# EAGLE schematic dimmerPower5 (EAGLE 9.2.0)
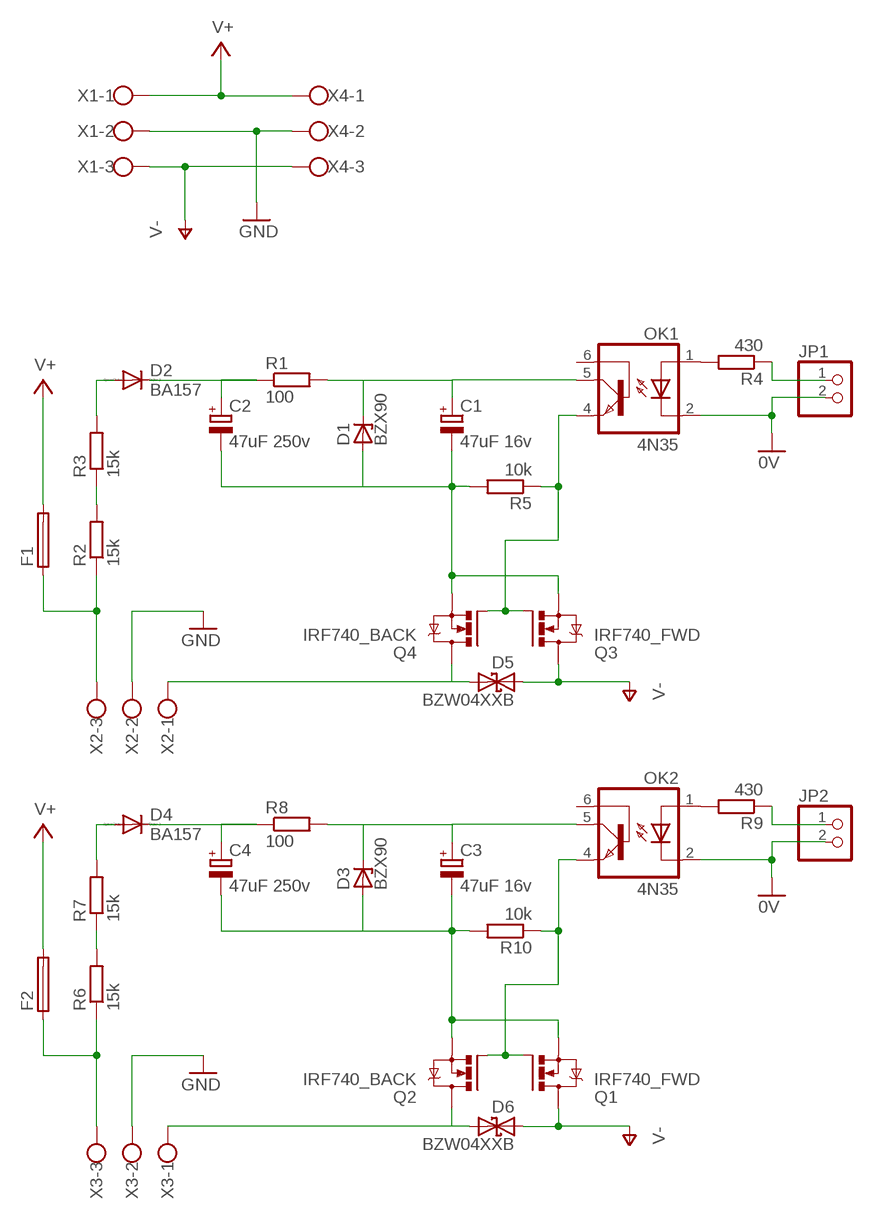
[diagram p0: schematic, sheet 1]

## Parts
C1  47uF 16v  CPOL-EUE2.5-6  [E2,5-6]
C2  47uF 250v  CPOL-EUE5-13  [E5-13]
C3  47uF 16v  CPOL-EUE2.5-6  [E2,5-6]
C4  47uF 250v  CPOL-EUE5-13  [E5-13]
D1  BZX90  [DO34Z7]
D2  BA157  [P1-10]
D3  BZX90  [DO34Z7]
D4  BA157  [P1-10]
D5  BZW04XXB  [F126Z12]
D6  BZW04XXB  [F126Z12]
F1  SH22,5  [SH22,5]
F2  SH22,5  [SH22,5]
JP1  PINHD-1X2  [1X02]
JP2  PINHD-1X2  [1X02]
OK1  4N35  [DIL06]
OK2  4N35  [DIL06]
Q1  IRF740_FWD  [TO220BV_FWD]
Q2  IRF740_BACK  [TO220BV_BACK]
Q3  IRF740_FWD  [TO220BV_FWD]
Q4  IRF740_BACK  [TO220BV_BACK]
R1  100  R-EU_0204/7  [0204/7]
R2  15k  R-EU_0613/15  [P0613/15]
R3  15k  R-EU_0613/15  [P0613/15]
R4  430  R-EU_0204/7  [0204/7]
R5  10k  R-EU_0204/7  [0204/7]
R6  15k  R-EU_0613/15  [P0613/15]
R7  15k  R-EU_0613/15  [P0613/15]
R8  100  R-EU_0204/7  [0204/7]
R9  430  R-EU_0204/7  [0204/7]
R10  10k  R-EU_0204/7  [0204/7]
X1  W237-103  [W237-103]
X2  W237-103  [W237-103]
X3  W237-103  [W237-103]
X4  W237-103  [W237-103]

## Nets
0V: JP1.2 JP2.2 OK1.2(C) OK2.2(C)
GND: X1.2 X2.2 X3.2 X4.2
N$1: C1.- C2.- D1.A Q3.S Q4.S R5.2
N$2: JP1.1 R4.1
N$3: OK1.1(A) R4.2
N$5: F1.1 R2.1 X2.3
N$6: R6.2 R7.1
N$7: R2.2 R3.1
N$8: D2.A R3.2
N$9: C2.+ D2.C R1.1
N$10: C1.+ D1.C OK1.5(COL) R1.2
N$11: OK1.4(EMI) Q3.G Q4.G R5.1
N$12: D5.C Q4.D X2.1
N$13: D4.A R7.2
N$14: C4.+ D4.C R8.1
N$15: C3.+ D3.C OK2.5(COL) R8.2
N$16: OK2.1(A) R9.2
N$17: D6.C Q2.D X3.1
N$18: JP2.1 R9.1
N$20: OK2.4(EMI) Q1.G Q2.G R10.1
N$21: C3.- C4.- D3.A Q1.S Q2.S R10.2
N$22: F2.1 R6.1 X3.3
V+: F1.2 F2.2 X1.1 X4.1
V-: D5.A D6.A Q1.D Q3.D X1.3 X4.3
Unconnected: OK1.6(BAS) OK2.6(BAS)

## Library data of the parts
C1-C4 = rcl:CPOL-EU: POLARIZED CAPACITOR, European symbol; SPICEPREFIX: C
D1 D3 = diode:BZX90: Z DIODE
D2 D4 = diode:BA157: DIODE fast soft-recovery controlled avalanche rectifier
D5 D6 = diode:BZW04XXB: DIODE uni and bidirectional supressor diode
F1 F2 = fuse:SH22,5: FUSE HOLDER grid 22,5 mm, OGN0031 8201, Schurter (Buerklin); MF: SCHURTER; MPN: 0031.8201; OC_FARNELL: 1162740; OC_NEWARK: 96F8317
JP1 JP2 = pinhead:PINHD-1X2: PIN HEADER
OK1 OK2 = optocoupler:4N35: MOTOROLA OPTO COUPLER; MF: FAIRCHILD SEMICONDUCTOR; MPN: 4N35; OC_FARNELL: 1328375; OC_NEWARK: 72K9946
Q1 Q3 = untitled:IRF740_FWD: N-CHANNEL MOS FET Drain back
Q2 Q4 = untitled:IRF740_BACK: N-CHANNEL MOS FET Drain back
R1-R10 = rcl:R-EU_: RESISTOR, European symbol; SPICEPREFIX: R
X1-X4 = con-wago-500:W237-103: WAGO SCREW CLAMP; MPN: 237-103; OC_FARNELL: unknown; OC_NEWARK: 18M7116

## Net classes
1 signal: width 1.27 mm, clearance 0.508 mm
2 power: width 2.54 mm, clearance 0.508 mm